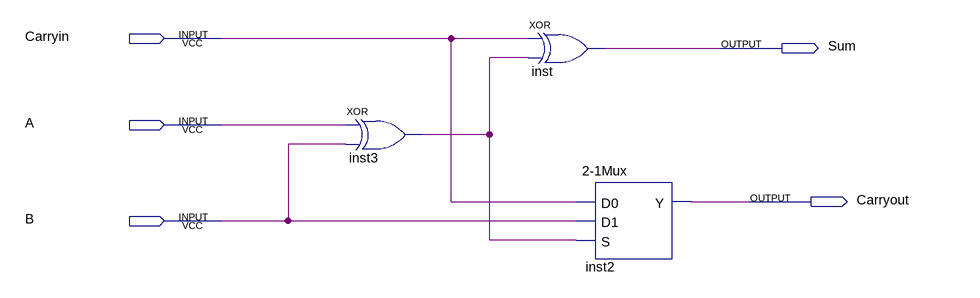
[diagram p0: schematic sheet]
// Quartus schematic 1BitAdder.bdf as structural Verilog: 3 symbols, 5 pins
module \1BitAdder  (
  input  Carryin,
  input  A,
  input  B,
  output Sum,
  output Carryout
);

  wire inst3_out;

  xor inst3 (inst3_out, A, B);
  xor inst (Sum, Carryin, inst3_out);
  \2-1Mux  inst2 (.D0(Carryin), .D1(B), .S(inst3_out), .Y(Carryout));
endmodule
